# Altium schematic sheet PWR_BootBat.SchDoc: PWR_BootBat
size A4; DrawnBy: BossFish; Revision: Test/v0.2; SheetNumber: 2; SheetTotal: 4
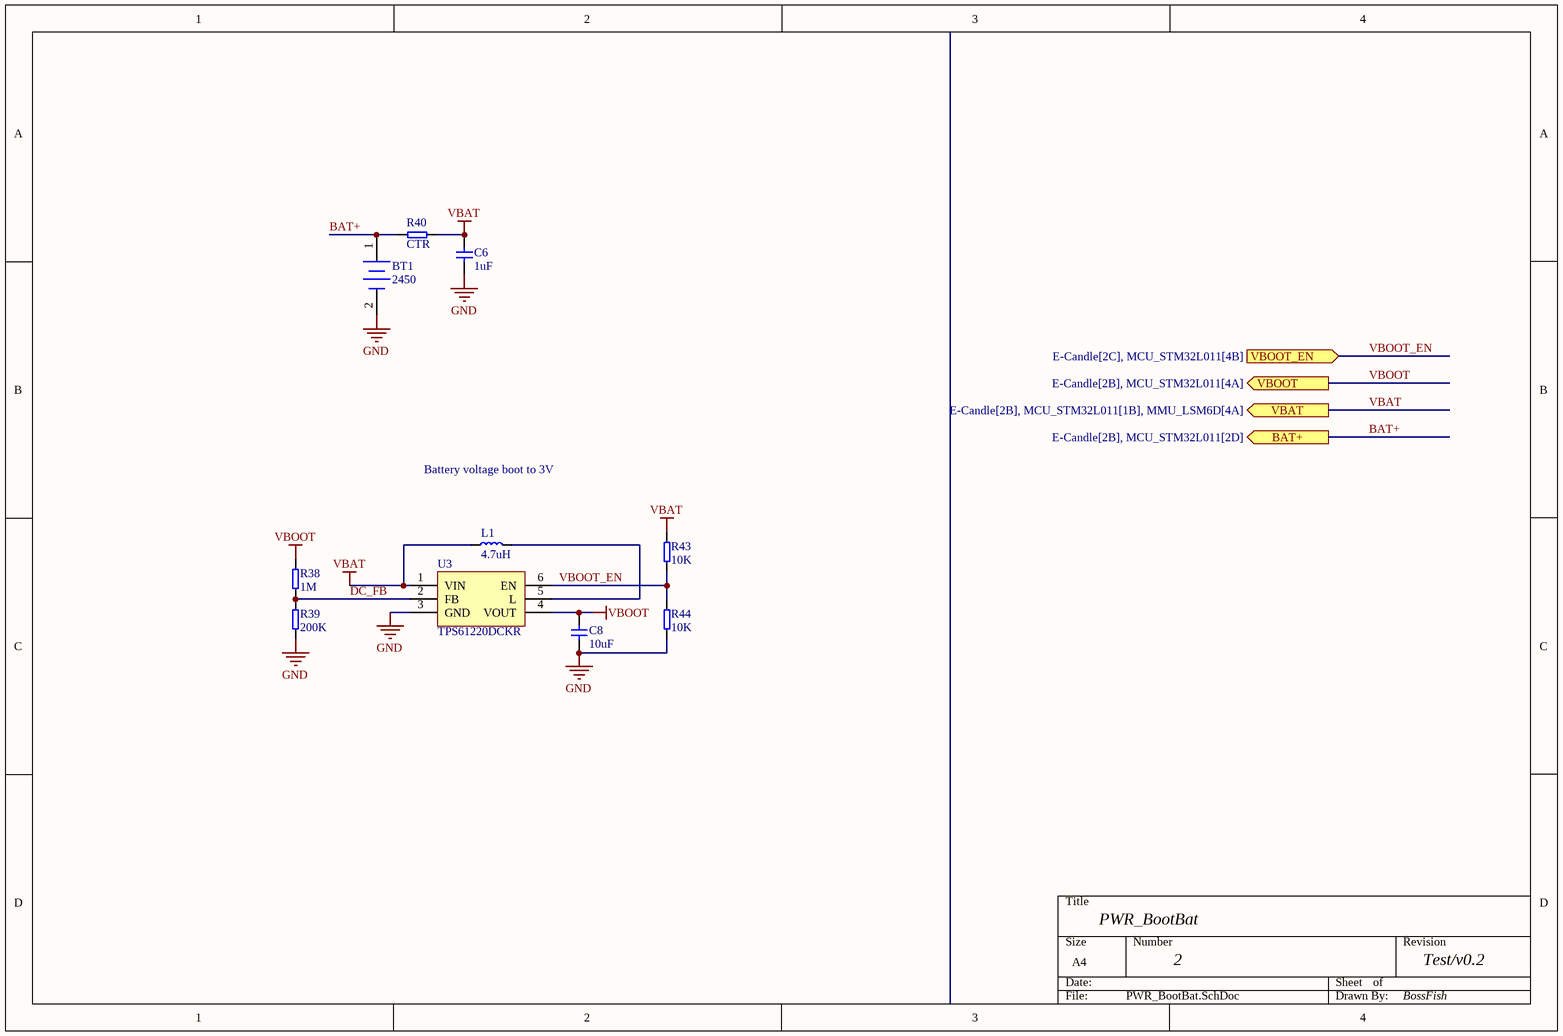
[diagram p0: PWR_BootBat.SchDoc]

## Parts
BT1  2450  [CR2450_CJ]
C6  1uF  [0603-C]
C8  10uF  [0603-C]
L1  4.7uH  [0805-L]
R38  1M  [0603-R]
R39  200K  [0603-R]
R40  CTR  [0603-R]
R43  10K  [0603-R]
R44  10K  [0603-R]
U3  TPS61220DCKR  [SC-70-6]

## Ports
BAT+ (out, see E-Candle[2B], MCU_STM32L011[2D]), VBAT (out, see E-Candle[2B], MCU_STM32L011[1B], MMU_LSM6D[4A]), VBOOT (out, see E-Candle[2B], MCU_STM32L011[4A]), VBOOT_EN (in, see E-Candle[2C], MCU_STM32L011[4B])

## Nets
GND: BT1.2(-) C6.1 C8.1 R39.1 R44.1 U3.3(GND)
VBAT: C6.2 L1.1 R40.1 R43.2 U3.1(VIN) ; port VBAT
VBOOT: C8.2 R38.2 U3.4(VOUT) ; port VBOOT
BAT+: BT1.1(+) R40.2 ; port BAT+
DC_FB: R38.1 R39.2 U3.2(FB)
VBOOT_EN: R43.1 R44.2 U3.6(EN) ; port VBOOT_EN
NetL1_2: L1.2 U3.5(L)

## Notes on the sheet
- Battery voltage boot to 3V

## Library data of the parts
BT1 = Battery: Multicell Battery; Published: 24-Mar-1999; LatestRevisionDate: 17-Jul-2002; LatestRevisionNote: Re-released for DXP Platform.; PackageReference: BAT-2; Publisher: Altium Limited; PackageDescription: Battery; 2 Leads
C6 C8 = Cap
L1 = Inductor
R38-R40 R43 R44 = Res
U3 = TPS61220DCKR: TPS6122x Low Input Voltage, 0.7V Boost Converter With 5.5μA Quiescent Current